# EAGLE board rev4.0 (EAGLE 7.5.0), part 1 of 2
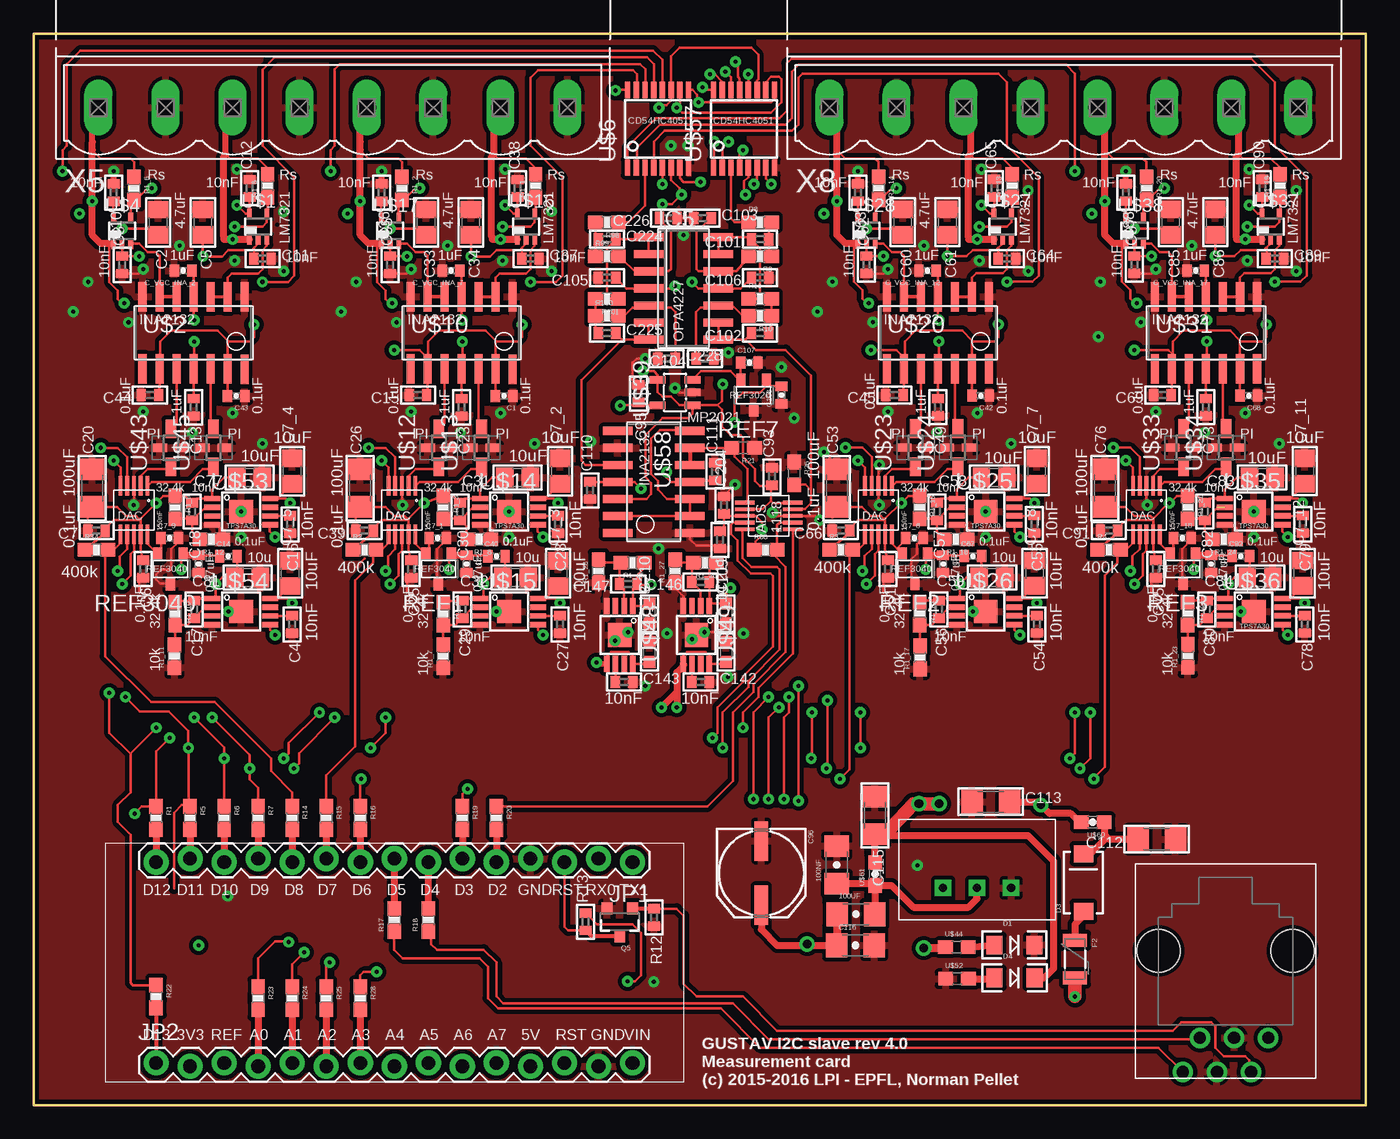
[diagram p4: board, top side]
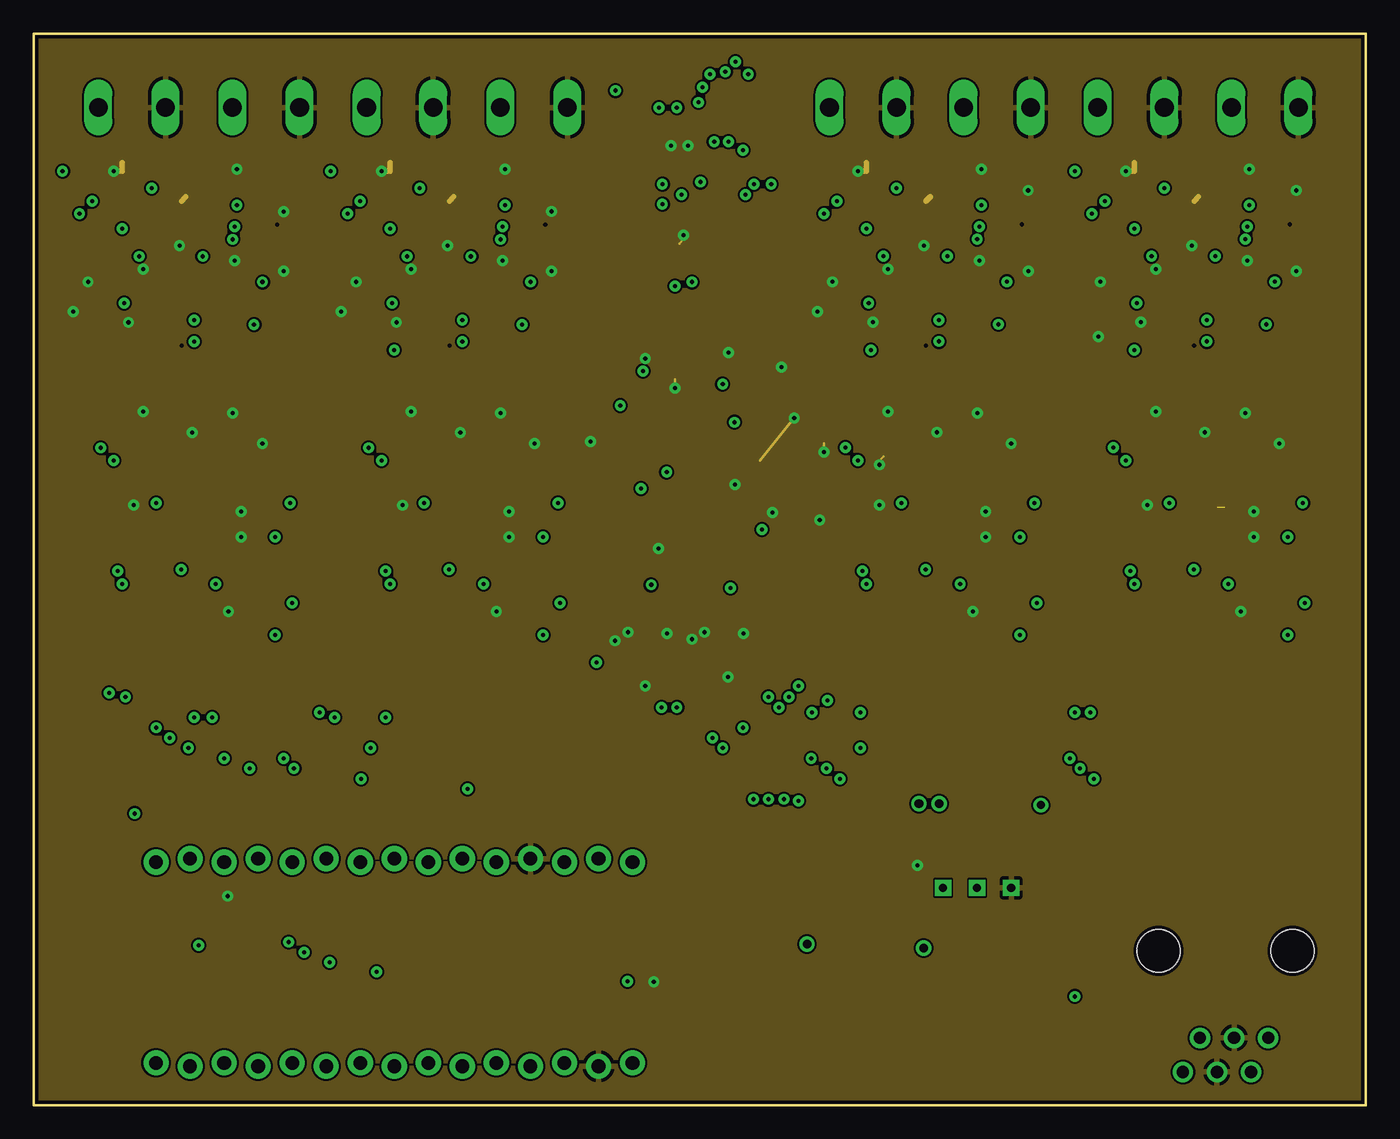
[diagram p5: board, inner layer Route2]
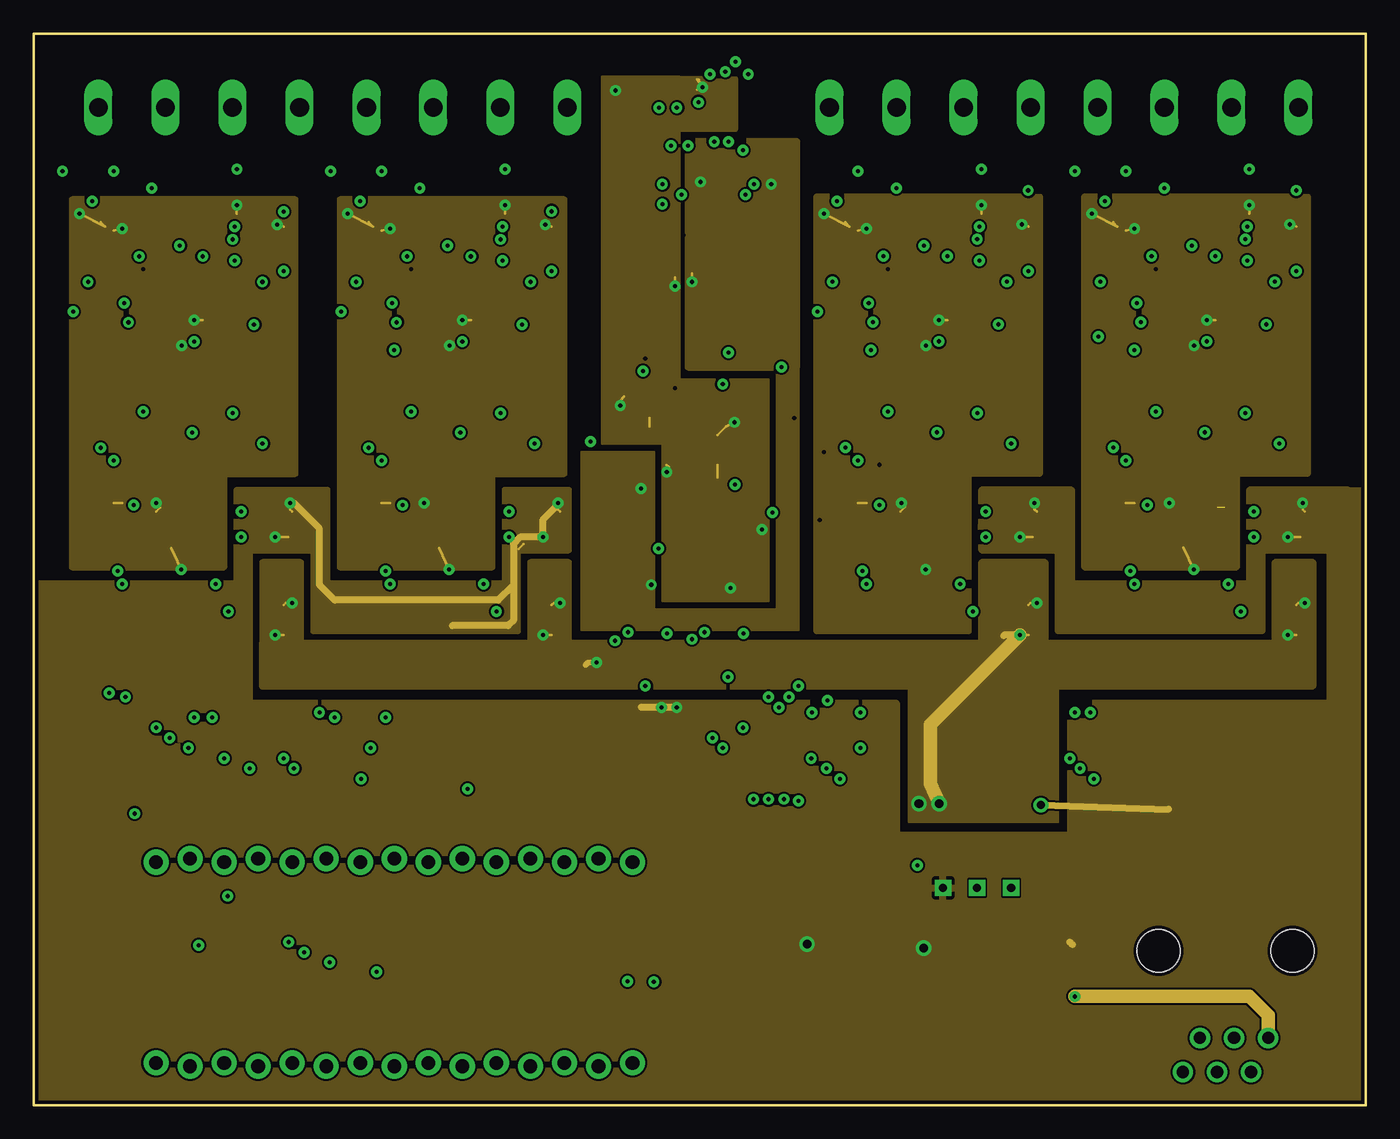
[diagram p6: board, inner layer Route15]
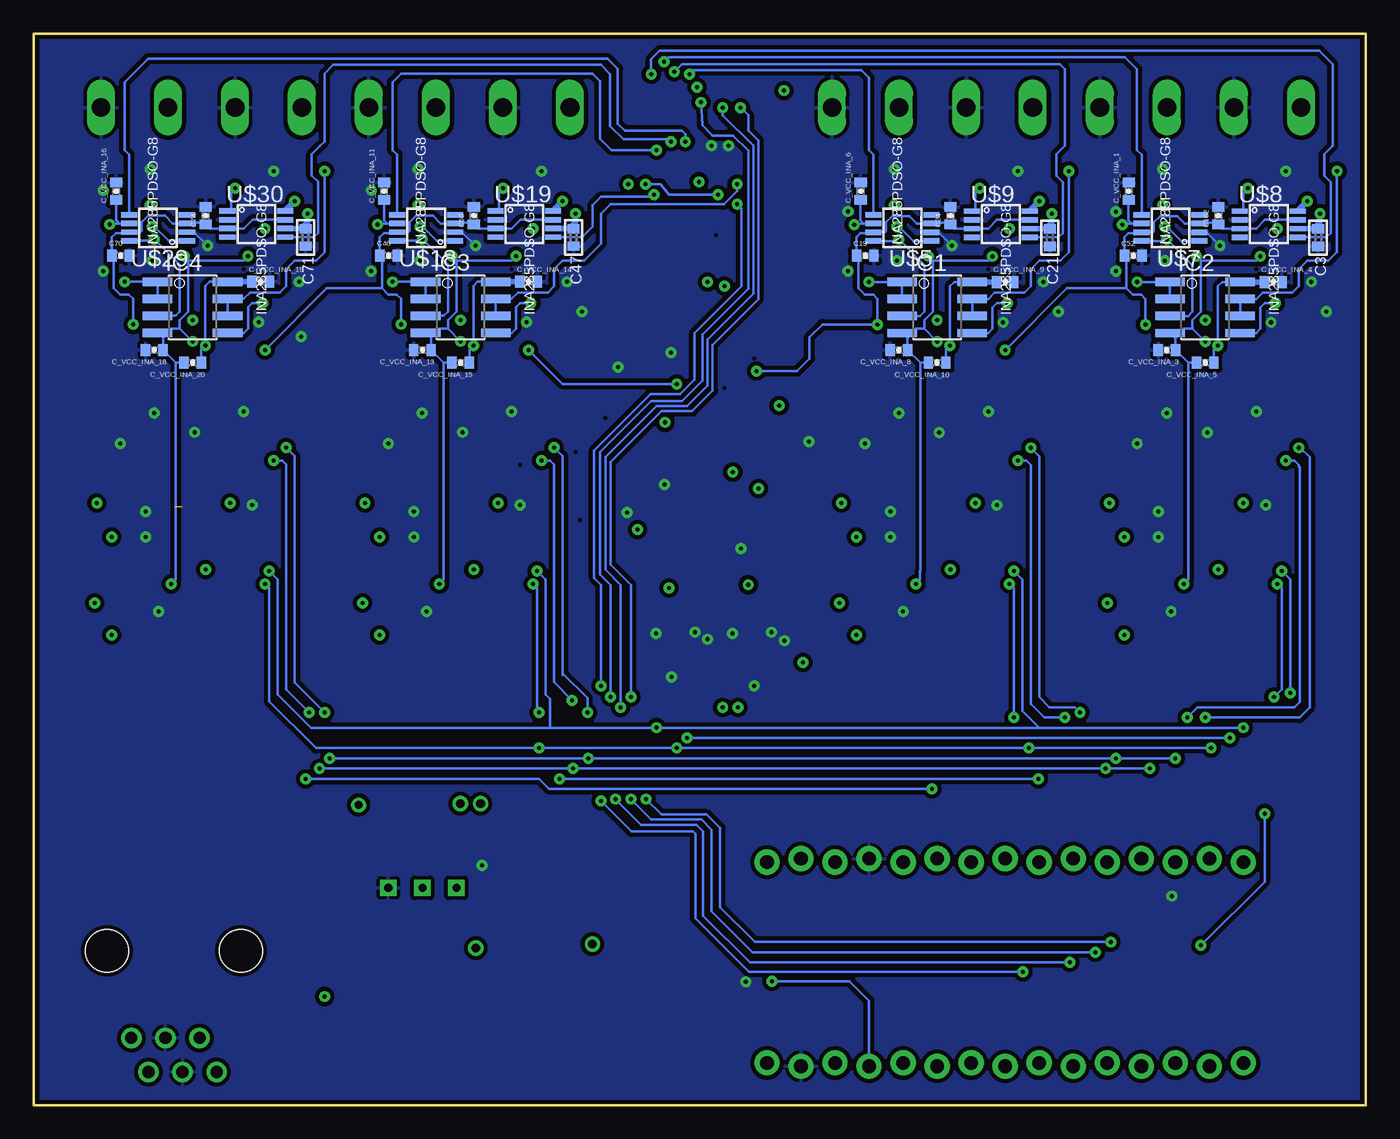
[diagram p7: board, bottom side, seen from below]

Size 99.45 x 80.01 mm. Coordinates in mm from the lower left corner, seen from the top.
Outline: 0,80.01 99.45,80.01 99.45,0 0,0 0,80.01
Copper layers ((1*2)+(15*16)): Top 0.035mm / dielectric 1.5mm / Route2 0.035mm / dielectric 0.15mm / Route15 0.035mm / dielectric 0.2mm / Bottom 0.035mm
Design rules "SparkFun *": minimum track width 8mil, minimum drill 20mil, track to track 6mil, track to pad 6mil, pad to pad 6mil, via to via 6mil, smd to smd 6mil, copper to edge 10mil, drill to drill 8mil, minimum pad ring 12mil, minimum via ring 10mil, stop-mask expansion 4mil, vias tented up to drill 25mil, thermal gap 10mil

## Footprints (pad centres in the part's own frame; a part is rotated, then mirrored left to right if it is on the bottom)
1206-CAP = smd 1.6 x 1.8: 1 -1.4,0; 2 1.4,0
0402-CAP = smd 0.7 x 0.9: 1 -0.65,0; 2 0.65,0
0805 = smd 1.3 x 1.5: 1 -0.95,0; 2 0.95,0
0402 = smd 0.7 x 0.9: 1 -0.65,0; 2 0.65,0
0603-MINI = smd 0.9 x 0.9: 1 -0.75,0; 2 0.75,0
1206 = smd 1.6 x 1.8: 1 -1.4,0; 2 1.4,0
NIPPON_F80 = smd 2.95 x 1: + 2.4,0; - -2.4,0
LED-1206 = smd 1.2 x 1.4: A -1.5,0; C 1.5,0
SMA-DIODE = smd 1.27 x 1.47: A -2.15,0; C 2.15,0
PTC-1206 = smd 1 x 1.8: 1 -1.4,0; 2 1.4,0
SO08 = smd 0.61 x 2.21: 1 -1.905,-2.616; 2 -0.635,-2.616; 3 0.635,-2.616; 4 1.905,-2.616; 5 1.905,2.616; 6 0.635,2.616; 7 -0.635,2.616; 8 -1.905,2.616
SO14 = smd 0.6 x 2.2: 1 -3.81,-2.6; 2 -2.54,-2.6; 3 -1.27,-2.6; 4 0,-2.6; 5 1.27,-2.6; 6 2.54,-2.6; 7 3.81,-2.6; 8 3.81,2.6; 9 2.54,2.6; 10 1.27,2.6; 11 0,2.6; 12 -1.27,2.6; 13 -2.54,2.6; 14 -3.81,2.6
1X15_LOCK = drill 1.016 pad 1.88: 1 0,0.127; 2 2.54,-0.127; 3 5.08,0.127; 4 7.62,-0.127; 5 10.16,0.127; 6 12.7,-0.127; 7 15.24,0.127; 8 17.78,-0.127; 9 20.32,0.127; 10 22.86,-0.127; 11 25.4,0.127; 12 27.94,-0.127; 13 30.48,0.127; 14 33.02,-0.127; 15 35.56,0.127
SOT23-3 = smd 0.8 x 0.9: 1 -0.95,-1; 2 0.95,-1; 3 0,1.1
0603-RES = smd 1.1 x 1: 1 -0.85,0; 2 0.85,0
0603 = smd 1.1 x 1: 1 -0.85,0; 2 0.85,0
DBZ_R-PDSO-G3 = smd 0.7 x 1: 1 -0.95,-1.1; 2 0.95,-1.1; 3 0,1.1
DCK_R-PDSO-G5 = smd 0.35 x 0.8: 1 -0.65,-0.95; 2 0,-0.95; 3 0.65,-0.95; 4 0.65,0.95; 5 -0.65,0.95
SO-14 = smd 0.6 x 2.2: 1 -3.81,-2.695; 2 -2.54,-2.695; 3 -1.27,-2.695; 4 0,-2.695; 5 1.27,-2.695; 6 2.54,-2.695; 7 3.81,-2.7; 8 3.81,2.7; 9 2.54,2.7; 10 1.27,2.7; 11 0,2.7; 12 -1.27,2.7; 13 -2.54,2.7; 14 -3.81,2.7
S-PDSO-G10 = smd 0.28 x 1.45: P1 -1,-1.8; P2 -0.5,-1.8; P3 0,-1.8; P4 0.5,-1.8; P5 1,-1.8; P6 1,1.8; P7 0.5,1.8; P8 0,1.8; P9 -0.5,1.8; P10 -1,1.8
S-PDSO-G08-NOTHERMALPAD = smd 0.4 x 1.2: 1 -0.975,-2.157; 2 -0.325,-2.157; 3 0.325,-2.157; 4 0.975,-2.157; 5 0.975,2.157; 6 0.325,2.157; 7 -0.325,2.157; 8 -0.975,2.157
PW_R-PDSO-G16 = smd 0.4 x 1.2: 1 -2.275,-2.9; 2 -1.625,-2.9; 3 -0.975,-2.9; 4 -0.325,-2.9; 5 0.325,-2.9; 6 0.975,-2.9; 7 1.625,-2.9; 8 2.275,-2.9; 9 2.275,2.9; 10 1.625,2.9; 11 0.975,2.9; 12 0.325,2.9; 13 -0.325,2.9; 14 -0.975,2.9; 15 -1.625,2.9; 16 -2.275,2.9
NFM21C = smd 1.4 x 0.8: 1 -1.425,0; 3 1.425,0 | smd 0.6 x 1.1: 2@1 0,-0.85; 2@2 0,0.85
S-PDSO-G08 = smd 0.4 x 1.2: 1 -0.975,-2.157; 2 -0.325,-2.157; 3 0.325,-2.157; 4 0.975,-2.157; 5 0.975,2.157; 6 0.325,2.157; 7 -0.325,2.157; 8 -0.975,2.157 | smd 1.73 x 1.78: TH 0,0
6P6C_TOP = drill 0.9: P1 -3.18,-7.54; P2 -1.905,-5; P3 -0.635,-7.54; P4 0.635,-5; P5 1.905,-7.54; P6 3.175,-5 | hole 3.2: 5,1.5; -5,1.5
SOT23-DBV = smd 0.55 x 1.2: 1 -0.95,-1.3; 2 0,-1.3; 3 0.95,-1.3; 4 0.95,1.3; 5 -0.95,1.3
TSRN1 = drill 0.6 square: P$1 -2.54,-1.35; P$2 0,-1.35; P$3 2.54,-1.35
MSTBV8 = drill 1.397 long: 1 -17.501,0; 2 -12.497,0; 3 -7.493,0; 4 -2.489,0; 5 2.515,0; 6 7.493,0; 7 12.497,0; 8 17.501,0

## Placement (x,y rotation side)
100NF  22uF  [1206-CAP]  59.95,17.97 90 top
100UF  100nF  [1206-CAP]  61.37,14.27 0 top
C1  0.1uF  [0402-CAP]  35.13,52.96 180 top
C2  4.7uF  [0805]  9.31,65.91 270 top
C3  1uF  [0402]  3.58,64.78 270 bottom
C4  10nF  [0402]  19.31,35.91 270 top
C5  4.7uF  [0805]  12.64,65.91 270 top
C6  100pF  [0402]  8.2,40.04 270 top
C7  100nF  [0402]  4.7,42.89 180 top
C7_1  150nF  [0402-CAP]  30.17,42.35 0 top
C7_2  10uF  [0805]  39.31,47.34 90 top
C7_3  10uF  [0805]  39.15,39.72 90 top
C7_4  10uF  [0805]  19.31,47.34 90 top
C7_5  10uF  [0805]  19.15,39.72 90 top
C7_6  150nF  [0402-CAP]  65.74,42.35 0 top
C7_7  10uF  [0805]  74.87,47.35 90 top
C7_8  10uF  [0805]  74.72,39.73 90 top
C7_9  150nF  [0402-CAP]  10.17,42.35 0 top
C7_10  150nF  [0402-CAP]  85.74,42.35 0 top
C7_11  10uF  [0805]  94.88,47.35 90 top
C7_12  10uF  [0805]  94.72,39.73 90 top
C7_13  150nF  [0603-MINI]  45.98,33.85 90 top
C7_14  150nF  [0603-MINI]  51.69,33.85 90 top
C8  10nF  [0402]  6.61,62.74 90 top
C9  0.47uF  [0402-CAP]  12.32,40.41 270 top
C10  10nF  [0402]  5.97,68.14 270 top
C11  10nF  [0402]  17.09,63.21 0 top
C12  10nF  [0402]  16.13,68.45 90 top
C13  1uF  [0402]  11.94,52.11 270 top
C14  100nF  [0402-CAP]  14.55,40.99 0 top
C15  0.1uF  [0402]  28.69,53.02 180 top
C16  10nF  [0402]  19.15,43.37 270 top
C17  10nF  [0402]  12.01,37.02 270 top
C18  10nF  [0402]  11.85,44.32 270 top
C19  0.1uF  [0402-CAP]  37.38,63.42 0 bottom
C20  100uF  [1206]  4.39,46.07 90 top
C21  1uF  [0402]  23.58,64.78 270 bottom
C22  0.47uF  [0402-CAP]  32.32,40.41 270 top
C23  1uF  [0402]  31.94,52.11 270 top
C24  0.1uF  [0402-CAP]  31.02,66.41 90 bottom
C25  100pF  [0402]  28.2,40.04 270 top
C26  100uF  [1206]  24.39,46.07 90 top
C27  10nF  [0402]  39.31,35.91 270 top
C28  10nF  [0402]  39.15,43.37 270 top
C29  10nF  [0402]  32.01,37.02 270 top
C30  10nF  [0402]  31.85,44.32 270 top
C31  10uF  [0805]  36.13,46.86 180 top
C32  10uF  [0805]  35.98,39.4 180 top
C33  4.7uF  [0805]  29.31,65.91 270 top
C34  4.7uF  [0805]  32.64,65.91 270 top
C35  10nF  [0402]  26.61,62.74 90 top
C36  10nF  [0402]  25.97,68.14 270 top
C37  10nF  [0402]  37.09,63.21 0 top
C38  10nF  [0402]  36.13,68.45 90 top
C39  100nF  [0402]  24.7,42.89 180 top
C40  100nF  [0402-CAP]  34.55,40.99 0 top
C42  0.1uF  [0402-CAP]  70.69,52.97 180 top
C43  0.1uF  [0402-CAP]  15.13,52.96 180 top
C44  0.1uF  [0402]  8.69,53.02 180 top
C45  0.1uF  [0402]  64.26,53.02 180 top
C46  0.1uF  [0402-CAP]  72.94,63.43 0 bottom
C47  1uF  [0402]  59.15,64.79 270 bottom
C48  0.47uF  [0402-CAP]  67.89,40.41 270 top
C49  1uF  [0402]  67.51,52.11 270 top
C50  0.1uF  [0402-CAP]  66.59,66.42 90 bottom
C51  100pF  [0402]  63.76,40.04 270 top
C52  0.1uF  [0402-CAP]  17.38,63.42 0 bottom
C53  100uF  [1206]  59.95,46.08 90 top
C54  10nF  [0402]  74.87,35.92 270 top
C55  10nF  [0402]  74.72,43.38 270 top
C56  10nF  [0402]  67.57,37.03 270 top
C57  10nF  [0402]  67.41,44.33 270 top
C58  10uF  [0805]  71.7,46.87 180 top
C59  10uF  [0805]  71.54,39.41 180 top
C60  4.7uF  [0805]  64.87,65.92 270 top
C61  4.7uF  [0805]  68.21,65.92 270 top
C62  10nF  [0402]  62.17,62.74 90 top
C63  10nF  [0402]  61.54,68.14 270 top
C64  10nF  [0402]  72.65,63.22 0 top
C65  10nF  [0402]  71.7,68.46 90 top
C66  100nF  [0402]  60.27,42.9 180 top
C67  100nF  [0402-CAP]  70.11,41 0 top
C68  0.1uF  [0402-CAP]  90.7,52.97 180 top
C69  0.1uF  [0402]  84.26,53.02 180 top
C70  0.1uF  [0402-CAP]  92.94,63.43 0 bottom
C71  1uF  [0402]  79.15,64.79 270 bottom
C72  0.47uF  [0402-CAP]  87.89,40.41 270 top
C73  1uF  [0402]  87.51,52.11 270 top
C74  0.1uF  [0402-CAP]  86.59,66.42 90 bottom
C75  100pF  [0402]  83.77,40.04 270 top
C76  100uF  [1206]  79.95,46.08 90 top
C77  10uF  [0805]  16.13,46.86 180 top
C78  10nF  [0402]  94.88,35.92 270 top
C79  10nF  [0402]  94.72,43.38 270 top
C80  10nF  [0402]  87.57,37.03 270 top
C81  10uF  [0805]  15.98,39.4 180 top
C82  10nF  [0402]  87.42,44.33 270 top
C83  10uF  [0805]  91.7,46.87 180 top
C84  10uF  [0805]  91.54,39.41 180 top
C85  4.7uF  [0805]  84.88,65.92 270 top
C86  4.7uF  [0805]  88.21,65.92 270 top
C87  10nF  [0402]  82.18,62.74 90 top
C88  10nF  [0402]  81.54,68.14 270 top
C89  10nF  [0402]  92.65,63.22 0 top
C90  10nF  [0402]  91.7,68.46 90 top
C91  100nF  [0402]  80.27,42.9 180 top
C92  100nF  [0402-CAP]  90.11,41 0 top
C93  0.1uF  [0402]  55.11,46.95 90 top
C95  0.1uF  [0402]  45.14,53.12 270 top
C96  100uF  [NIPPON_F80]  54.32,17.34 270 top
C101  120nF  [0402]  54.23,64.64 180 top
C102  750nF  [0402]  54.23,57.66 180 top
C103  100nF  [0402]  49.93,66.23 0 top
C104  100nF  [0402]  50.11,55.75 180 top
C105  120nF  [0402]  42.8,61.79 180 top
C106  120nF  [0402]  54.23,61.79 180 top
C107  0.47uF  [0402-CAP]  53.42,55.45 0 top
C108  0.47uF  [0402-CAP]  55.82,53.01 90 top
C109  0.1uF  [0402]  51.24,42.21 270 top
C110  120nF  [0402]  41.53,45.91 90 top
C111  120nF  [0402]  50.88,47.31 90 top
C112  22uF  [1206]  83.83,19.88 180 top
C113  22uF  [1206]  71.44,22.67 0 top
C115  22uF  [1206]  62.81,21.65 270 top
C116  100nF  [1206-CAP]  61.35,11.94 0 top
C142  0.1uF  [0402]  49.79,31.62 0 top
C143  0.1uF  [0402]  44.07,31.62 0 top
C146  0.1uF  [0402]  49.79,39.08 180 top
C147  0.1uF  [0402]  44.39,38.93 180 top
C162  0.1uF  [0402-CAP]  11.02,66.41 90 bottom
C204  0.1uF  [0402]  51.54,44.8 90 top
C210  0.1uF  [0603-MINI]  45.98,36.7 90 top
C211  0.1uF  [0603-MINI]  51.69,36.7 90 top
C224  120nF  [0402]  42.8,64.64 0 top
C225  750nF  [0402]  42.8,57.66 0 top
C226  100nF  [0402]  47.38,66.24 180 top
C228  100nF  [0402]  47.25,55.75 0 top
C_VCC_INA_1  0.1uF  [0402-CAP]  17.72,68.23 90 bottom
C_VCC_INA_2  0.1uF  [0402-CAP]  11.17,62.3 180 top
C_VCC_INA_3  0.1uF  [0402-CAP]  14.86,56.39 180 bottom
C_VCC_INA_4  0.1uF  [0402-CAP]  6.93,61.47 0 bottom
C_VCC_INA_5  0.1uF  [0402-CAP]  12.01,55.44 180 bottom
C_VCC_INA_6  0.1uF  [0402-CAP]  37.72,68.23 90 bottom
C_VCC_INA_7  0.1uF  [0402-CAP]  31.17,62.3 180 top
C_VCC_INA_8  0.1uF  [0402-CAP]  34.86,56.39 180 bottom
C_VCC_INA_9  0.1uF  [0402-CAP]  26.93,61.47 0 bottom
C_VCC_INA_10  0.1uF  [0402-CAP]  32.01,55.44 180 bottom
C_VCC_INA_11  0.1uF  [0402-CAP]  73.28,68.24 90 bottom
C_VCC_INA_12  0.1uF  [0402-CAP]  66.73,62.31 180 top
C_VCC_INA_13  0.1uF  [0402-CAP]  70.43,56.39 180 bottom
C_VCC_INA_14  0.1uF  [0402-CAP]  62.49,61.47 0 bottom
C_VCC_INA_15  0.1uF  [0402-CAP]  67.57,55.44 180 bottom
C_VCC_INA_16  0.1uF  [0402-CAP]  93.28,68.24 90 bottom
C_VCC_INA_17  0.1uF  [0402-CAP]  86.74,62.31 180 top
C_VCC_INA_18  0.1uF  [0402-CAP]  90.43,56.39 180 bottom
C_VCC_INA_19  0.1uF  [0402-CAP]  82.49,61.47 0 bottom
C_VCC_INA_20  0.1uF  [0402-CAP]  87.57,55.44 180 bottom
D1  RED  [LED-1206]  73.21,11.98 0 top
D3  [SMA-DIODE]  78.36,16.64 90 top
D4  RED  [LED-1206]  73.22,9.53 0 top
F2  PTCSMD  [PTC-1206]  77.73,10.92 270 top
IC1  OPA2130U  [SO08]  32.01,59.56 270 bottom
IC2  OPA2130U  [SO08]  12.01,59.56 270 bottom
IC3  OPA2130U  [SO08]  67.57,59.57 270 bottom
IC4  OPA2130U  [SO08]  87.57,59.57 270 bottom
IC5  OPA4227D  [SO14]  48.52,60.99 270 top
JP1  M15LOCK  [1X15_LOCK]  44.71,18.29 180 top
JP2  M15LOCK  [1X15_LOCK]  9.15,3.05 0 top
Q5  MOSFET-NCHANNELAO3404A  [SOT23-3]  43.76,13.72 180 top
R1  330  [0603-RES]  9.15,21.46 270 top
R1_1  1  [0603-RES]  37.47,68.64 90 top
R1_2  1  [0603-RES]  27.5,68.45 270 top
R1_3  32.4k  [0603-RES]  30.58,44.64 270 top
R1_4  32.4k  [0603-RES]  30.58,36.7 270 top
R1_5  1  [0603-RES]  17.47,68.64 90 top
R1_6  1  [0603-RES]  7.5,68.45 270 top
R1_7  10k  [0603-RES]  30.57,33.53 90 top
R1_8  10k  [0603-RES]  33.28,42.26 180 top
R1_9  32.4k  [0603-RES]  10.58,44.64 270 top
R1_10  32.4k  [0603-RES]  10.58,36.7 270 top
R1_11  10k  [0603-RES]  10.52,33.53 90 top
R1_12  10k  [0603-RES]  13.28,42.26 180 top
R1_13  1  [0603-RES]  73.04,68.65 90 top
R1_14  1  [0603-RES]  63.07,68.45 270 top
R1_15  32.4k  [0603-RES]  66.14,44.65 270 top
R1_16  32.4k  [0603-RES]  66.14,36.71 270 top
R1_17  10k  [0603-RES]  66.17,33.44 90 top
R1_18  10k  [0603-RES]  68.84,42.27 180 top
R1_19  1  [0603-RES]  93.04,68.65 90 top
R1_20  1  [0603-RES]  83.07,68.45 270 top
R1_21  32.4k  [0603-RES]  86.15,44.65 270 top
R1_22  32.4k  [0603-RES]  86.15,36.71 270 top
R1_23  10k  [0603-RES]  86.16,33.55 90 top
R1_24  10k  [0603-RES]  88.84,42.27 180 top
R1_25  32.4k  [0603-RES]  44.71,40.51 180 top
R1_26  32.4k  [0603-RES]  50.11,40.51 180 top
R1_27  10k  [0603-RES]  47.88,39.88 90 top
R1_28  10k  [0603-RES]  42.17,39.88 90 top
R2  400k  [0603-RES]  24.7,41.47 0 top
R3  400k  [0603-RES]  60.27,41.47 0 top
R4  400k  [0603-RES]  80.27,41.47 0 top
R5  330  [0603-RES]  11.69,21.46 270 top
R6  330  [0603-RES]  14.23,21.46 270 top
R7  330  [0603-RES]  16.77,21.46 270 top
R8  12.4k  [0603-RES]  54.23,65.91 0 top
R9  16.9k  [0603-RES]  54.23,63.37 180 top
R10  7.87k  [0603-RES]  54.23,58.93 180 top
R11  4.22k  [0603-RES]  54.23,60.2 0 top
R12  100k  [0402]  46.3,14.03 270 top
R13  100k  [0402]  41.22,13.72 90 top
R14  330  [0603-RES]  19.31,21.46 270 top
R15  330  [0603-RES]  21.85,21.46 270 top
R16  330  [0603-RES]  24.39,21.46 270 top
R17  330  [0603-RES]  26.93,13.84 90 top
R18  330  [0603-RES]  29.47,13.84 90 top
R19  330  [0603-RES]  32.01,21.46 270 top
R20  330  [0603-RES]  34.55,21.46 270 top
R21  10k  [0603]  52.96,49.09 180 top
R22  330  [0603-RES]  9.15,8.13 270 top
R23  330  [0603-RES]  16.77,8 270 top
R24  330  [0603-RES]  19.31,8 270 top
R25  330  [0603-RES]  21.85,8 270 top
R26  10k  [0603]  56.77,47.18 270 top
R28  330  [0603-RES]  24.39,8 270 top
R34  400k  [0603-RES]  4.7,41.47 0 top
R88  400k  [0603-RES]  54.65,41.47 0 top
R98  12.4k  [0603-RES]  42.8,65.91 180 top
R99  169  [0603-RES]  42.8,63.37 0 top
R100  7.870k  [0603-RES]  42.8,58.93 0 top
R101  4.22k  [0603-RES]  42.8,60.2 180 top
REF1  REF3040  [DBZ_R-PDSO-G3]  30.22,40.05 180 top
REF2  REF3040  [DBZ_R-PDSO-G3]  65.79,40.06 180 top
REF3  REF3040  [DBZ_R-PDSO-G3]  85.79,40.06 180 top
REF7  REF3020  [DBZ_R-PDSO-G3]  53.75,53.01 180 top
REF3040  REF3040  [DBZ_R-PDSO-G3]  10.22,40.05 180 top
U$1  LM7321  [DCK_R-PDSO-G5]  16.77,65.6 0 top
U$2  INA2132  [SO-14]  11.94,57.66 0 top
U$3  DAC7563  [S-PDSO-G10]  7.5,44.44 180 top
U$4  LM7321  [DCK_R-PDSO-G5]  6.61,65.28 0 top
U$5  INA285PDSO-G8  [S-PDSO-G08-NOTHERMALPAD]  34.59,65.5 90 bottom
U$6  CD54HC4051  [PW_R-PDSO-G16]  46.61,72.9 0 top
U$7  INA285PDSO-G8  [S-PDSO-G08-NOTHERMALPAD]  14.59,65.5 90 bottom
U$8  INA285PDSO-G8  [S-PDSO-G08-NOTHERMALPAD]  7.26,65.77 270 bottom
U$9  INA285PDSO-G8  [S-PDSO-G08-NOTHERMALPAD]  27.26,65.77 270 bottom
U$10  INA2132  [SO-14]  31.94,57.66 0 top
U$11  DAC7563  [S-PDSO-G10]  27.5,44.44 180 top
U$12  CLC  [NFM21C]  30.26,49.09 90 top
U$13  CLC  [NFM21C]  33.44,49.09 90 top
U$14  TPS7A30  [S-PDSO-G08]  35.5,44.32 270 top
U$15  TPS7A30  [S-PDSO-G08]  35.5,36.86 270 top
U$16  LM7321  [DCK_R-PDSO-G5]  36.77,65.6 0 top
U$17  LM7321  [DCK_R-PDSO-G5]  26.61,65.28 0 top
U$18  INA285PDSO-G8  [S-PDSO-G08-NOTHERMALPAD]  70.16,65.51 90 bottom
U$19  INA285PDSO-G8  [S-PDSO-G08-NOTHERMALPAD]  62.82,65.78 270 bottom
U$20  INA2132  [SO-14]  67.51,57.66 0 top
U$21  DAC7563  [S-PDSO-G10]  63.06,44.44 180 top
U$22  6P6C_TOP  [6P6C_TOP]  88.97,10.03 0 top
U$23  CLC  [NFM21C]  65.83,49.09 90 top
U$24  CLC  [NFM21C]  69,49.09 90 top
U$25  TPS7A30  [S-PDSO-G08]  71.06,44.33 270 top
U$26  TPS7A30  [S-PDSO-G08]  71.06,36.87 270 top
U$27  LM7321  [DCK_R-PDSO-G5]  72.33,65.6 0 top
U$28  LM7321  [DCK_R-PDSO-G5]  62.17,65.28 0 top
U$29  INA285PDSO-G8  [S-PDSO-G08-NOTHERMALPAD]  90.16,65.51 90 bottom
U$30  INA285PDSO-G8  [S-PDSO-G08-NOTHERMALPAD]  82.82,65.78 270 bottom
U$31  INA2132  [SO-14]  87.51,57.66 0 top
U$32  DAC7563  [S-PDSO-G10]  83.07,44.44 180 top
U$33  CLC  [NFM21C]  85.83,49.09 90 top
U$34  CLC  [NFM21C]  89,49.09 90 top
U$35  TPS7A30  [S-PDSO-G08]  91.07,44.33 270 top
U$36  TPS7A30  [S-PDSO-G08]  91.07,36.87 270 top
U$37  LM7321  [DCK_R-PDSO-G5]  92.34,65.6 0 top
U$38  LM7321  [DCK_R-PDSO-G5]  82.18,65.28 0 top
U$39  LMP2021  [SOT23-DBV]  47.88,53.21 90 top
U$40  ADS1018  [S-PDSO-G10]  54.87,44.01 90 top
U$42  TSRN1  [TSRN1]  70.43,17.59 0 top
U$43  CLC  [NFM21C]  10.26,49.09 90 top
U$44  0.05OHM-1/5W-1%(0603)  [0603]  68.91,11.82 0 top
U$45  CLC  [NFM21C]  13.44,49.09 90 top
U$48  TPS7A30  [S-PDSO-G08]  43.76,35.12 180 top
U$49  TPS7A30  [S-PDSO-G08]  49.47,35.12 180 top
U$52  0.05OHM-1/5W-1%(0603)  [0603]  68.93,9.46 0 top
U$53  TPS7A30  [S-PDSO-G08]  15.5,44.32 270 top
U$54  TPS7A30  [S-PDSO-G08]  15.5,36.86 270 top
U$57  CD54HC4051  [PW_R-PDSO-G16]  53.03,72.9 0 top
U$58  INA2132  [SO-14]  46.3,46.55 270 top
U$60  [0603]  79.06,21.15 180 top
U$61  [0603]  62.81,17.27 90 top
X5  [MSTBV8]  22.35,74.49 0 top
X8  [MSTBV8]  76.91,74.49 0 top